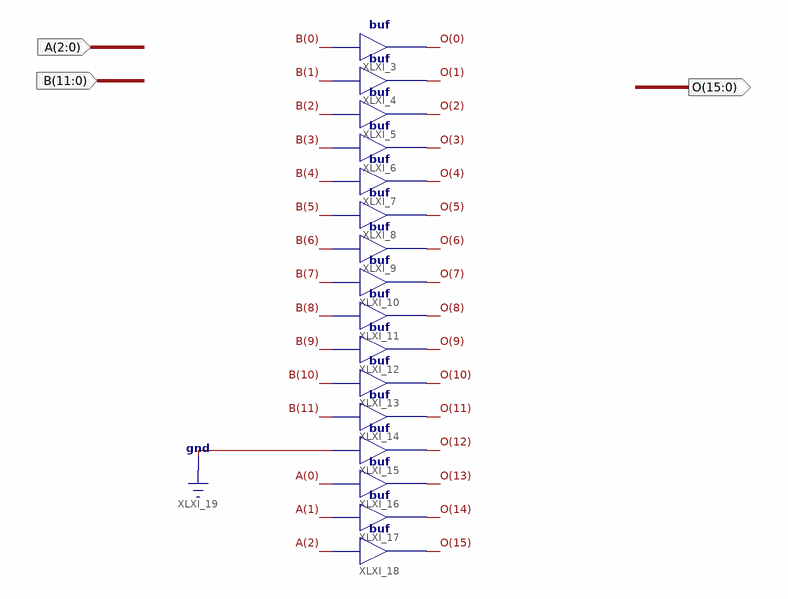
[diagram p0: schematic sheet 1]
// Xilinx ISE schematic catbox.sch (spartan3e) as structural Verilog: 16 symbols, 3 ports
module catbox (
  input  [2:0] A,
  input  [11:0] B,
  output [15:0] O
);

  buf XLXI_3 (O[0], B[0]);
  buf XLXI_4 (O[1], B[1]);
  buf XLXI_5 (O[2], B[2]);
  buf XLXI_6 (O[3], B[3]);
  buf XLXI_7 (O[4], B[4]);
  buf XLXI_8 (O[5], B[5]);
  buf XLXI_9 (O[6], B[6]);
  buf XLXI_10 (O[7], B[7]);
  buf XLXI_11 (O[8], B[8]);
  buf XLXI_12 (O[9], B[9]);
  buf XLXI_13 (O[10], B[10]);
  buf XLXI_14 (O[11], B[11]);
  buf XLXI_15 (O[12], 1'b0);
  buf XLXI_16 (O[13], A[0]);
  buf XLXI_17 (O[14], A[1]);
  buf XLXI_18 (O[15], A[2]);
endmodule
